# EAGLE design Edin_Usher_DRV2630_reference_design (EAGLE 9.6.2)
COMPANY: Unexpected Maker; DATE: 24-10-2018; DRAWN: Seon; REV: V1; TITLE: TinyPICO

## Sheet 1 of 2
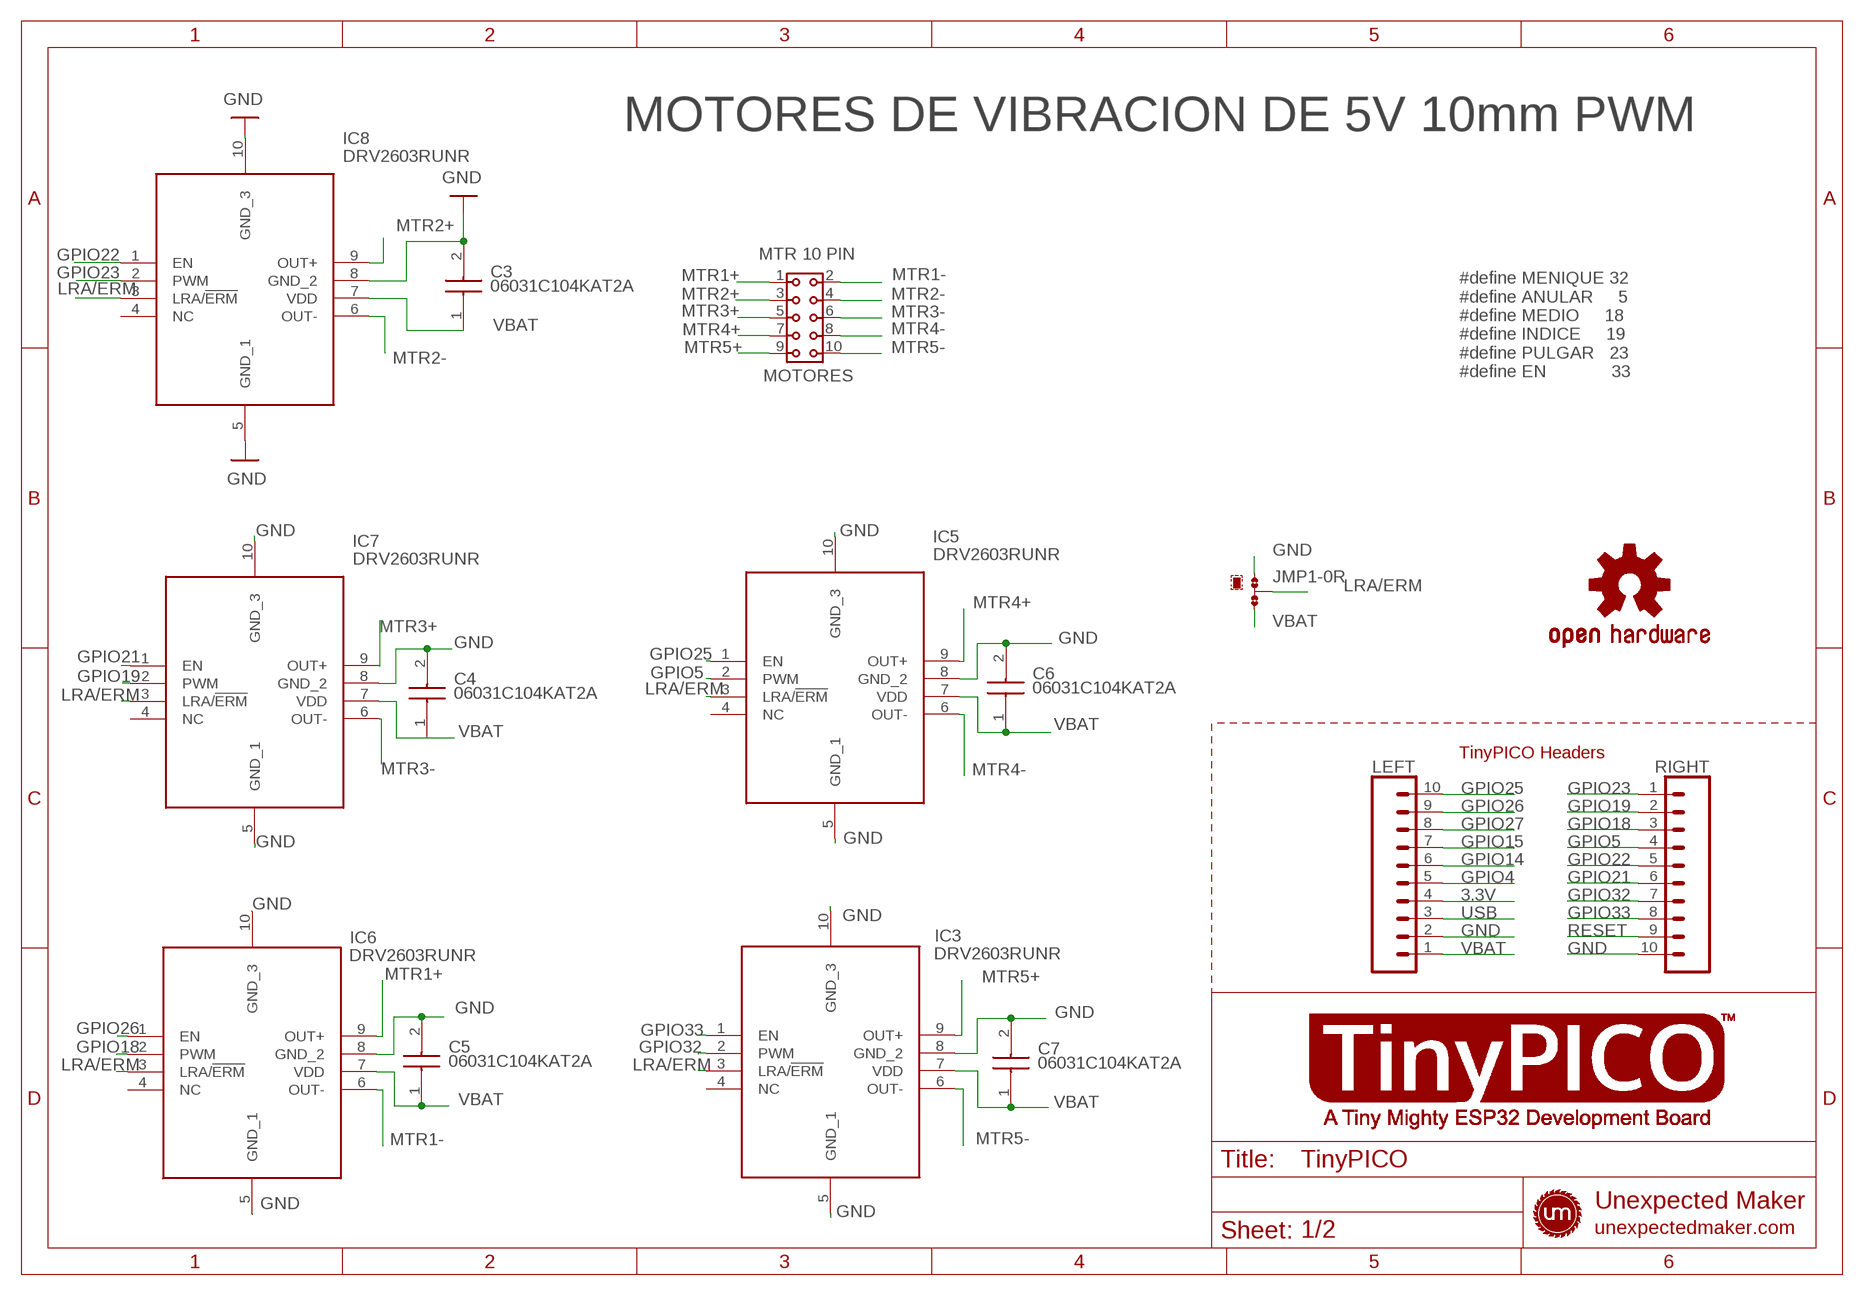
[diagram p0: schematic, sheet 1]

### Parts
C3  06031C104KAT2A  [CAPC1608X90N]
C4  06031C104KAT2A  [CAPC1608X90N]
C5  06031C104KAT2A  [CAPC1608X90N]
C6  06031C104KAT2A  [CAPC1608X90N]
C7  06031C104KAT2A  [CAPC1608X90N]
IC3  DRV2603RUNR  [QFN50P200X200X80-10N]
IC5  DRV2603RUNR  [QFN50P200X200X80-10N]
IC6  DRV2603RUNR  [QFN50P200X200X80-10N]
IC7  DRV2603RUNR  [QFN50P200X200X80-10N]
IC8  DRV2603RUNR  [QFN50P200X200X80-10N]
JMP1  0R-JUMPA  [A0R-JMP]
LEFT  TINYPICO_HEADER_10NO_SILK_PTH_FEMALE  [1X10_NO_SILK]
LOGO1  OSHW-LOGOS  [OSHW-LOGO-S]
MOTORES  MTR 10 PIN  6130XX21821_61301021821  [61301021821]
RIGHT  TINYPICO_HEADER_10NO_SILK_PTH_FEMALE  [1X10_NO_SILK]

### Nets
3.3V: LEFT.4 ; also sheet 2
GND: C3.2 C4.2 C5.2 C6.2 C7.2 IC3.5(GND_1) IC3.8(GND_2) IC3.10(GND_3) IC5.5(GND_1) IC5.8(GND_2) IC5.10(GND_3) IC6.5(GND_1) IC6.8(GND_2) IC6.10(GND_3) IC7.5(GND_1) IC7.8(GND_2) IC7.10(GND_3) IC8.5(GND_1) IC8.8(GND_2) IC8.10(GND_3) JMP1.1 LEFT.2 RIGHT.10 ; also sheet 2
GPIO4: LEFT.5 ; also sheet 2
GPIO5: IC5.2(PWM) RIGHT.4
GPIO14: LEFT.6 ; also sheet 2
GPIO15: LEFT.7 ; also sheet 2
GPIO18: IC6.2(PWM) RIGHT.3
GPIO19: IC7.2(PWM) RIGHT.2
GPIO21: IC7.1(EN) RIGHT.6
GPIO22: IC8.1(EN) RIGHT.5
GPIO23: IC8.2(PWM) RIGHT.1
GPIO25: IC5.1(EN) LEFT.10
GPIO26: IC6.1(EN) LEFT.9
GPIO27: LEFT.8 ; also sheet 2
GPIO32: IC3.2(PWM) RIGHT.7
GPIO33: IC3.1(EN) RIGHT.8
LRA/ERM: IC3.3(LRA/!ERM) IC5.3(LRA/!ERM) IC6.3(LRA/!ERM) IC7.3(LRA/!ERM) IC8.3(LRA/!ERM) JMP1.2
MTR1+: IC6.9(OUT+) MOTORES.1
MTR1-: IC6.6(OUT-) MOTORES.2
MTR2+: IC8.9(OUT+) MOTORES.3
MTR2-: IC8.6(OUT-) MOTORES.4
MTR3+: IC7.9(OUT+) MOTORES.5
MTR3-: IC7.6(OUT-) MOTORES.6
MTR4+: IC5.9(OUT+) MOTORES.7
MTR4-: IC5.6(OUT-) MOTORES.8
MTR5+: IC3.9(OUT+) MOTORES.9
MTR5-: IC3.6(OUT-) MOTORES.10
RESET: RIGHT.9 ; also sheet 2
USB: LEFT.3
VBAT: C3.1 C4.1 C5.1 C6.1 C7.1 IC3.7(VDD) IC5.7(VDD) IC6.7(VDD) IC7.7(VDD) IC8.7(VDD) JMP1.3 LEFT.1
Unconnected: IC3.4(NC) IC5.4(NC) IC6.4(NC) IC7.4(NC) IC8.4(NC)

### Notes on the sheet
- MOTORES DE VIBRACION DE 5V 10mm PWM
- #define MENIQUE 32
  #define ANULAR     5
  #define MEDIO     18
  #define INDICE     19
  #define PULGAR   23
  #define EN             33
- TinyPICO Headers

## Sheet 2 of 2: Botons
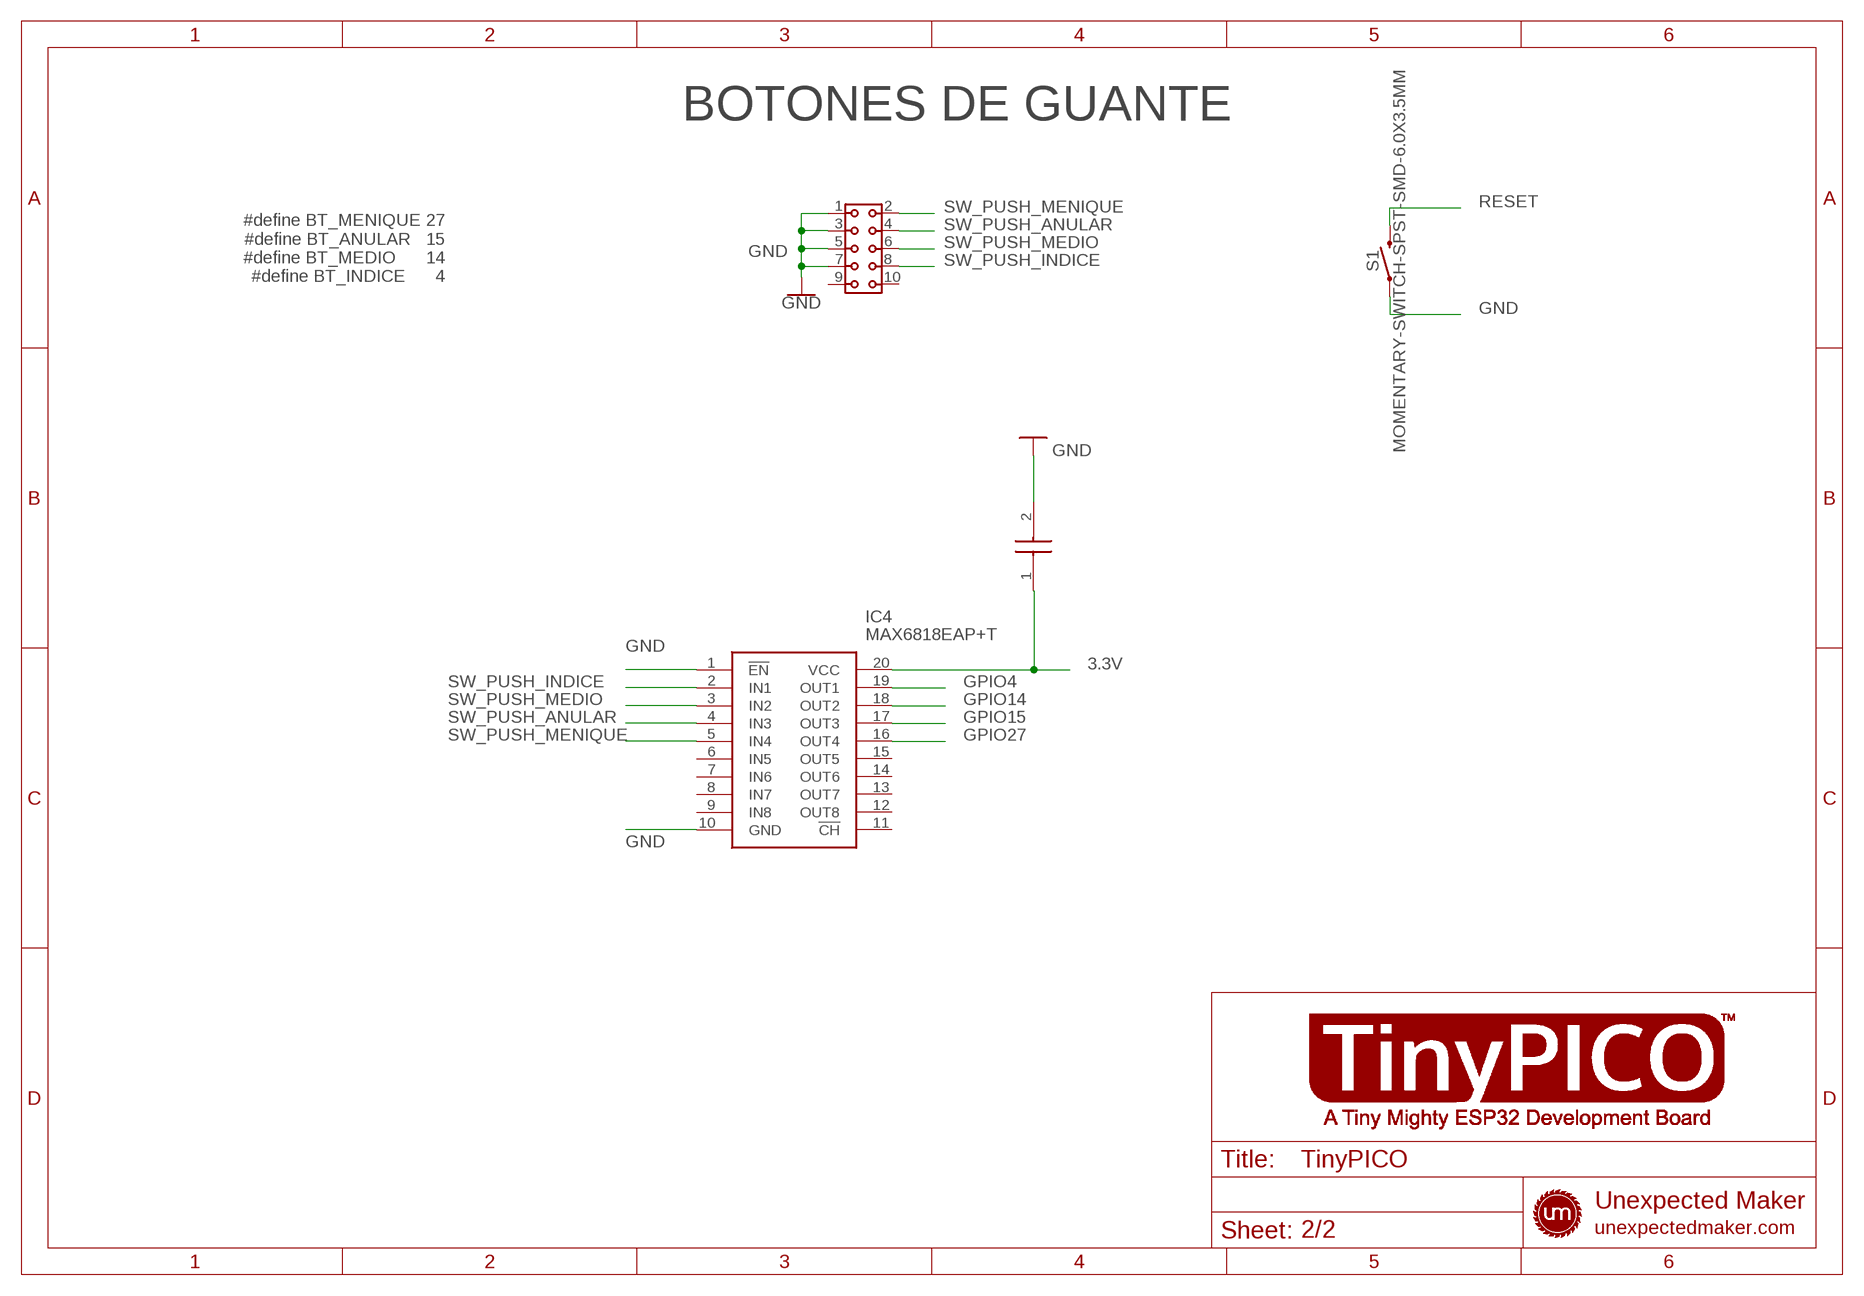
[diagram p1: schematic, sheet 2]

### Parts
BOTONES  BTN 10 PIN  6130XX21821_61301021821  [61301021821]
C8  0603B104K160CT  [CAPC1608X87N]
IC4  MAX6818EAP+T  [SOP65P778X199-20N]
S1  MOMENTARY-SWITCH-SPST-SMD-6.0X3.5MM  [TACTILE_SWITCH_SMD_6.0X3.5MM]

### Nets
3.3V: C8.1 IC4.20(VCC) ; also sheet 1
GND: BOTONES.1 BOTONES.3 BOTONES.5 BOTONES.7 C8.2 IC4.1(!EN) IC4.10(GND) S1.1 ; also sheet 1
GPIO4: IC4.19(OUT1) ; also sheet 1
GPIO14: IC4.18(OUT2) ; also sheet 1
GPIO15: IC4.17(OUT3) ; also sheet 1
GPIO27: IC4.16(OUT4) ; also sheet 1
RESET: S1.2 ; also sheet 1
SW_PUSH_ANULAR: BOTONES.4 IC4.4(IN3)
SW_PUSH_INDICE: BOTONES.8 IC4.2(IN1)
SW_PUSH_MEDIO: BOTONES.6 IC4.3(IN2)
SW_PUSH_MENIQUE: BOTONES.2 IC4.5(IN4)
Unconnected: BOTONES.9 BOTONES.10 IC4.6(IN5) IC4.7(IN6) IC4.8(IN7) IC4.9(IN8) IC4.11(!CH) IC4.12(OUT8) IC4.13(OUT7) IC4.14(OUT6) IC4.15(OUT5)

### Notes on the sheet
- BOTONES DE GUANTE
- #define BT_MENIQUE 27
  #define BT_ANULAR   15
  #define BT_MEDIO      14
  #define BT_INDICE      4

## Library data of the parts
BOTONES MOTORES = Wurth_Connectors_WR-PHD:6130XX21821_61301021821: WR-PHD 2.54 mm Dual Socket Header ARTICLE PROPERTIES: Pins:4;​ 6;​ 8;​ 10;​ 12;​ 14;​ 16;​ 18;​ 20;​ 22;​ 24;​ 26;​ 28;​ 30;​ 32;​ 34;​ 36;​ 40;​ 44;​ 64;​ 72 KIND PROPERTIES: Pitch：2.54 mm Quality Class:3 as per CECC 75 301-802 Rows：Dual Gender：Socket Header Type：Straight MATERIAL PROPERTIES: Insulator Material :PBT Insulator Flammability Rating:UL94 V-0 Contact Material:Copper Alloy Contact Plating:Gold Contact Type:Stamped GENERAL INFORMATION Operating Temperature:-40 up to +125 °C Compliance:Lead free / RoHS ELECTRICAL PROPERTIES: Rated Current:3 A IR 1:3 A Withstanding Voltage:500 V (AC) Contact Resistance:20 mΩ RISO:1000 MΩ CERTIFICATION UL Approval:E323964 PACKAGING PROPERTIES Packaging:Tray <https://katalog.we-online.com/media/images/v2/o57948v209%20Family_Dual_Socket_Header_WR-PHD_6130xx21821.jpg> Details see: https://katalog.we-online.com/en/em/PHD_2_54_DUAL_SOCKET_HEADER_6130XX21821 Updated by Yingchun,Shan 2019-10-21 2019 (C) Würth Elektronik; DATASHEET-URL: https://katalog.we-online.com/em/datasheet/61301021821.pdf; GENDER: Socket Header; IR: 3A; MATES: WR-PHD 2.54mm SMT Dual Pin Header/THT Angled Dual Pin Header/THT Dual Board Stacker/THT Dual Pin Header; PACKAGING: Tray; PART-NUMBER: 61301021821; PINS: 10; ROWS: Dual; TYPE: Straight
C3-C7 = SamacSys_Parts:06031C104KAT2A: AVX - 06031C104KAT2A - CAP, MLCC, X7R, 0.1UF, 100V, 0603 Source: Datasheet <https://componentsearchengine.com/Datasheets/1/06031A100FAT2A.pdf>; DESCRIPTION: AVX - 06031C104KAT2A - CAP, MLCC, X7R, 0.1UF, 100V, 0603; HEIGHT: 0.9mm; MANUFACTURER_NAME: AVX; MANUFACTURER_PART_NUMBER: 06031C104KAT2A; MOUSER_PART_NUMBER: 581-06031C104KAT2A; MOUSER_PRICE-STOCK: https://www.mouser.co.uk/ProductDetail/AVX/06031C104KAT2A?qs=oF%2FSscNnLpBUv12UcNAw2A%3D%3D
C8 = SamacSys_Parts:0603B104K160CT: WALSIN - 0603B104K160CT - CAP, 0.1F, 16V, 10%, X7R, 0603 Source: Datasheet <https://componentsearchengine.com/Datasheets/1/0603B104K160CT.pdf>; DESCRIPTION: WALSIN - 0603B104K160CT - CAP, 0.1F, 16V, 10%, X7R, 0603; HEIGHT: 0.87mm; MANUFACTURER_NAME: Walsin Technology Corporation; MANUFACTURER_PART_NUMBER: 0603B104K160CT; MOUSER_PART_NUMBER: 791-0603B104K160CT; MOUSER_PRICE-STOCK: https://www.mouser.com/Search/Refine.aspx?Keyword=791-0603B104K160CT
IC3 IC5-IC8 = SamacSys_Parts:DRV2603RUNR: Haptic Driver with Auto Resonance Tracking for LRA and Optimized Drive for ERM Source: Datasheet <http://www.ti.com/lit/gpn/drv2603>; DESCRIPTION: Haptic Driver with Auto Resonance Tracking for LRA and Optimized Drive for ERM; HEIGHT: 0.8mm; MANUFACTURER_NAME: Texas Instruments; MANUFACTURER_PART_NUMBER: DRV2603RUNR; MOUSER_PART_NUMBER: 595-DRV2603RUNR; MOUSER_PRICE-STOCK: https://www.mouser.co.uk/ProductDetail/Texas-Instruments/DRV2603RUNR?qs=l6ZoeTYLMwNhoGl8Q31%2FaA%3D%3D
IC4 = SamacSys_Parts:MAX6818EAP+T: MAXIM INTEGRATED PRODUCTS - MAX6818EAP+T. - ESD PROTE WITH SWITCH DEBOUNCER, SSOP-20 Source: Datasheet; DESCRIPTION: MAXIM INTEGRATED PRODUCTS - MAX6818EAP+T. - ESD PROTE WITH SWITCH DEBOUNCER, SSOP-20; HEIGHT: 1.99mm; MANUFACTURER_NAME: Maxim Integrated; MANUFACTURER_PART_NUMBER: MAX6818EAP+T; MOUSER_PART_NUMBER: 700-MAX6818EAPT; MOUSER_PRICE-STOCK: https://www.mouser.co.uk/ProductDetail/Maxim-Integrated/MAX6818EAP%2bT?qs=CDqwynd4ZNoKt6d34O8j%252BA%3D%3D
JMP1 = jump-0r-smd:0R-JUMP: SMD 0R 0805 Jumper
LEFT RIGHT = UnexpectedMaker:TINYPICO_HEADER_10: Multi connection point. Often used as Generic Header-pin footprint for 0.1 inch spaced/style header connections On any of the 0.1 inch spaced packages, you can populate with these: Break Away Headers - Straight <https://www.sparkfun.com/products/116> (PRT-00116) Break Away Male Headers - Right Angle <https://www.sparkfun.com/products/553> (PRT-00553) Female Headers <https://www.sparkfun.com/products/115> (PRT-00115) Break Away Headers - Machine Pin <https://www.sparkfun.com/products/117> (PRT-00117) Break Away Female Headers - Swiss Machine Pin <https://www.sparkfun.com/products/743> (PRT-00743) Arduino Stackable Header - 10 Pin <https://www.sparkfun.com/products/11376> (PRT-11376) For SCREWTERMINALS and SPRING TERMINALS visit here: Screw Terimnals on SparkFun.com <https://www.sparkfun.com/search/results?term=Screw+Terminals> (5mm/3.5mm/2.54mm spacing) This device is also useful as a general connection point to wire up your design to another part of your project. Our various solder wires solder well into these plated through hole pads. Hook-Up Wire - Assortment (Stranded, 22 AWG) <https://www.sparkfun.com/products/11375> (PRT-11375) Hook-Up Wire - Assortment (Solid Core, 22 AWG) <https://www.sparkfun.com/products/11367> (PRT-11367) View the entire wire category on our website here <https://www.sparkfun.com/categories/141> Special notes: Molex polarized connector foot print use with SKU : PRT-08231 with associated crimp pins and housings. 1MM SMD Version SKU: PRT-10208 NOTES ON THE VARIANTS LOCK and LOCK_LONGPADS... This footprint was designed to help hold the alignment of a through-hole component (i.e. 6-pin header) while soldering it into place. You may notice that each hole has been shifted either up or down by 0.005 of an inch from it's more standard position (which is a perfectly straight line). This slight alteration caused the pins (the squares in the middle) to touch the edges of the holes. Because they are alternating, it causes a "brace" to hold the component in place. 0.005 has proven to be the perfect amount of "off-center" position when using our standard breakaway headers. Although looks a little odd when you look at the bare footprint, once you have a header in there, the alteration is very hard to notice. Also,if you push a header all the way into place, it is covered up entirely on the bottom side.; PROD_ID: CONN-11563
LOGO1 = SparkFun-Aesthetics:OSHW-LOGO: Open-Source Hardware (OSHW) Logo This logo indicates the piece of hardware it is found on incorporates a OSHW license and/or adheres to the definition of open source hardware found here: http://freedomdefined.org/OSHW
S1 = SparkFun-Switches:MOMENTARY-SWITCH-SPST: Momentary Switch (Pushbutton) - SPST Normally-open (NO) SPST momentary switches (buttons, pushbuttons). Variants PTH-12MM - 12mm square, through-hole Momentary Pushbutton Switch - 12mm Square <https://www.sparkfun.com/products/9190> (COM-09190) PTH-6.0MM, PTH-6.0MM-KIT - 6.0mm square, through-hole Mini Pushbutton Switch <https://www.sparkfun.com/products/97> (COM-00097) KIT package intended for soldering kit's - only one side of pads' copper is exposed. PTH-RIGHT-ANGLE-KIT - Right-angle, through-hole Right Angle Tactile Button <https://www.sparkfun.com/products/10791> - Used on SparkFun BigTime Watch Kit <https://www.sparkfun.com/products/11734> SMD-12MM - 12mm square, surface-mount Tactile Button - SMD (12mm) <https://www.sparkfun.com/products/12993> (COM-12993) Used on SparkFun PicoBoard <https://www.sparkfun.com/products/11888> SMD-4.5MM - 4.5mm Square Trackball Switch Used on SparkFun Blackberry Trackballer Breakout <https://www.sparkfun.com/products/13169> SMD-4.6MMX2.8MM - 4.60mm x 2.80mm, surface mount Used on SparkFun SAMD21 Mini Breakout <https://www.sparkfun.com/products/13664> SMD-5.2MM, SMD-5.2-REDUNDANT - 5.2mm square, surface-mount Mini Pushbutton Switch - SMD <https://www.sparkfun.com/products/8720> (COM-08720) Used on Arduino Pro Mini <https://www.sparkfun.com/products/11114> REDUNDANT package connects both switch circuits together SMD-6.0X3.5MM - 6.0 x 3.5mm, surface mount Momentary Reset Switch SMD <https://www.sparkfun.com/products/8229> (COM-08229) SMD-6.2MM-TALL - 6.2mm square, surface mount Tactile Button - SMD (6mm) <https://www.sparkfun.com/products/12992> Used on SparkFun Digital Sandbox <https://www.sparkfun.com/products/12651> SMD-RIGHT-ANGLE - Right-angle, surface mount Used on SparkFun Block for Intel® Edison - Arduino <https://www.sparkfun.com/products/13036>; PROD_ID: SWCH-00815; SF_SKU: COM-08229

## Board
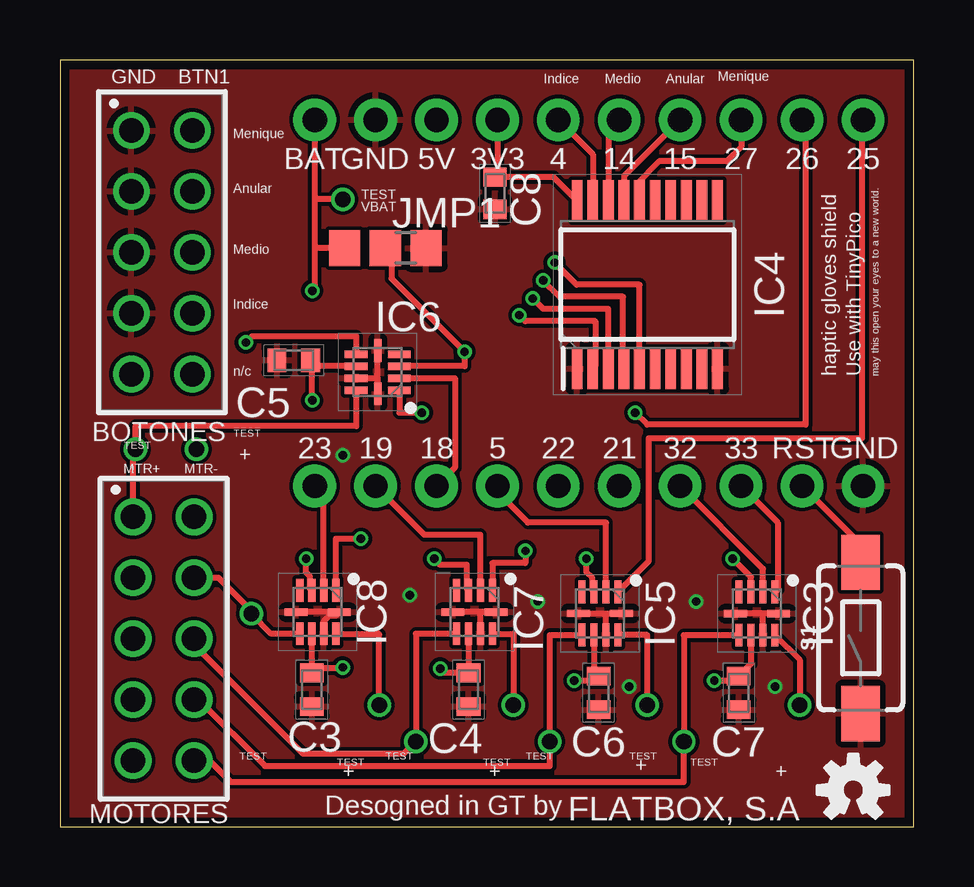
[diagram p2: board, top side]
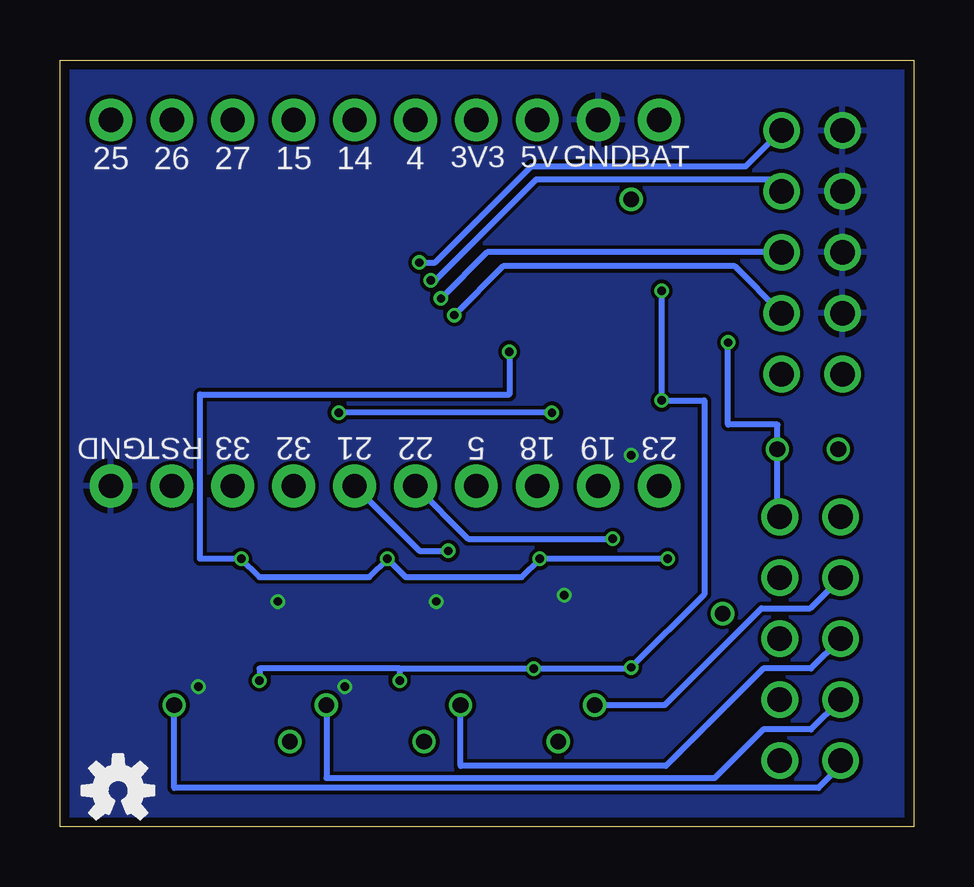
[diagram p3: board, bottom side, seen from below]

Size 35.6 x 31.97 mm. Coordinates in mm from the lower left corner, seen from the top.
Outline: 0,31.97 0,0 35.6,0 35.6,31.97 0,31.97
Copper layers (1*16): Top 0.035559375mm / dielectric 1.6mm / Bottom 0.035559375mm
Design rules "oshpark-2layer": minimum track width 6mil, minimum drill 10mil, track to track 6mil, track to pad 6mil, pad to pad 6mil, via to via 6mil, smd to smd 6mil, copper to edge 15mil, drill to drill 6mil, minimum pad ring 5mil, minimum via ring 5mil, stop-mask expansion 2.5mil, vias tented up to drill 0mil, thermal gap 10mil

### Footprints (pad centres in the part's own frame; a part is rotated, then mirrored left to right if it is on the bottom)
61301021821 = drill 1.02: 1 -5.08,-1.27; 2 -5.08,1.27; 3 -2.54,-1.27; 4 -2.54,1.27; 5 0,-1.27; 6 0,1.27; 7 2.54,-1.27; 8 2.54,1.27; 9 5.08,-1.27; 10 5.08,1.27
CAPC1608X90N = smd 0.78 x 0.99: 1 -0.7,0; 2 0.7,0
CAPC1608X87N = smd 0.8 x 0.94: 1 -0.67,0; 2 0.67,0
QFN50P200X200X80-10N = smd 0.95 x 0.3: 1 -0.9,0.75; 2 -0.9,0.25; 3 -0.9,-0.25; 4 -0.9,-0.75; 6 0.9,-0.75; 7 0.9,-0.25; 8 0.9,0.25; 9 0.9,0.75 | smd 0.3 x 0.95: 5 0,-0.9; 10 0,0.9
SOP65P778X199-20N = smd 1.705 x 0.45: 1 -3.498,2.925; 2 -3.498,2.275; 3 -3.498,1.625; 4 -3.498,0.975; 5 -3.498,0.325; 6 -3.498,-0.325; 7 -3.498,-0.975; 8 -3.498,-1.625; 9 -3.498,-2.275; 10 -3.498,-2.925; 11 3.498,-2.925; 12 3.498,-2.275; 13 3.498,-1.625; 14 3.498,-0.975; 15 3.498,-0.325; 16 3.498,0.325; 17 3.498,0.975; 18 3.498,1.625; 19 3.498,2.275; 20 3.498,2.925
A0R-JMP = smd 1.5 x 1.3: 1 0,1.7; 2 0,0; 3 0,-1.7
1X10_NO_SILK = drill 1.016 pad 1.778: 1 0,0; 2 2.54,0; 3 5.08,0; 4 7.62,0; 5 10.16,0; 6 12.7,0; 7 15.24,0; 8 17.78,0; 9 20.32,0; 10 22.86,0
TACTILE_SWITCH_SMD_6.0X3.5MM = smd 2.3 x 1.6: 1 -3.15,0; 2 3.15,0

### Placement (x,y rotation side)
BOTONES  4.25,23.95 270 top
C3  10.5,5.71 270 top
C4  17.03,5.71 270 top
C5  9.75,19.45 180 top
C6  22.45,5.59 270 top
C7  28.3,5.59 270 top
C8  18.14,26.41 270 top
IC3  29.06,8.89 270 top
IC4  24.49,22.6 90 top
IC5  22.51,8.9 270 top
IC6  13.25,18.95 180 top
IC7  17.28,8.95 270 top
IC8  10.75,8.95 270 top
JMP1  13.56,24.13 270 top
LEFT  10.62,29.47 0 top
LOGO1  33.07,1.53 0 top
LOGO2  OSHW-LOGOS  [OSHW-LOGO-S]  33.17,1.51 0 bottom
MOTORES  4.32,7.84 270 top
RIGHT  10.62,14.21 0 top
S1  33.38,7.87 90 top

### Tracks (layer width: path | path; a pad name or v marks a point on that pad's centre or on a via)
3.3V
  Top 0.254: LEFT.4 18.24,27.19 C8.1 20.58,27.08 IC4.20
GND  (via drill 0.35)
  Top 0.254: IC8.8 11,8.57 11.23,8.81 11.5,8.81 IC8.10 IC8.5 | IC6.8 13.25,18.7 IC6.10 IC6.5 | 21.86,8.9 IC5.5 22.76,8.9 | IC3.10 29.31,8.89 | 29.31,8.89 IC3.5 | IC3.8 29.31,8.89 | 22.76,8.9 IC5.10 | IC5.8 22.76,8.9 | IC7.10 17.53,8.95 | 17.53,8.95 IC7.5 | IC7.8 17.53,8.95
  other vias: 23.72,5.84 14.58,9.65 19.91,9.4 29.82,5.84 26.52,9.4 11.79,15.49
  pour Bottom: 35.63,33.37 35.63,-3.68 -1.02,-3.68 -1.02,33.37
  pour Top: -1.17,33.53 -1.17,-4.57 35.66,-4.57 35.66,33.53
GPIO4
  Top 0.254: LEFT.5 22.21,28.04 IC4.19
GPIO5
  Top 0.254: IC5.2 22.76,12.69 19.51,12.69 18.24,13.96 RIGHT.4
GPIO14
  Top 0.254: LEFT.6 22.86,29.02 IC4.18
GPIO15
  Top 0.254: LEFT.7 23.51,27.13 IC4.17
GPIO18
  Top 0.254: IC6.2 16.46,18.7 16.46,14.97 RIGHT.3
GPIO19
  Top 0.254: IC7.2 17.52,9.87 17.52,12.18 15.19,12.18 RIGHT.2
GPIO21  (via drill 0.35)
  Top 0.254: v19.41,11.5 19.41,10.99 18.03,10.99 IC7.1
  Bottom 0.254: RIGHT.6 20.61,11.5 v19.41,11.5
GPIO22  (via drill 0.35)
  Top 0.254: v12.55,12.01 11.5,12.01 IC8.1
  Bottom 0.254: RIGHT.5 18.58,12.01 v12.55,12.01
GPIO23
  Top 0.254: IC8.2 11,13.83 RIGHT.1
GPIO25
  Top 0.254: IC5.1 24.53,11.07 24.53,16.2 33.44,16.2 33.44,29.48 LEFT.10
GPIO26  (via drill 0.35)
  Top 0.254: IC6.1 14.15,17.27 v15.09,17.27 | v23.98,17.27 24.49,16.76 31.09,16.76 31.09,29.48 LEFT.9
  Bottom 0.254: v15.09,17.27 v23.98,17.27
GPIO27
  Top 0.254: LEFT.8 28.4,28.35 27.79,27.74 24.98,27.74 24.05,26.82 24.05,26.21 IC4.16
GPIO32
  Top 0.254: IC3.2 29.31,10.76 RIGHT.7
GPIO33
  Top 0.254: RIGHT.8 29.92,12.69 29.92,9.9 IC3.1
LRA/ERM  (via drill 0.35)
  Top 0.254: JMP1.2 13.82,23.87 13.82,22.86 v16.87,19.81 16.87,19.2 IC6.3 | IC8.3 10.43,9.92 10.43,10.44 10.26,10.61 v10.26,11.17 | IC7.3 16.96,9.92 16.96,10.92 15.85,10.92 v15.6,11.17 | IC5.3 22.19,9.87 22.19,10.39 21.95,10.63 v21.95,11.17 | IC3.3 28.81,10.41 v28.04,11.17
  Bottom 0.254: v10.26,11.17 v15.6,11.17 16.36,10.41 21.18,10.41 v21.95,11.17 22.71,10.41 27.28,10.41 v28.04,11.17 29.76,11.17 29.76,18.03 16.87,18.03 v16.87,19.81
MTR1+  (via drill 0.65)
  Top 0.254: IC6.9 12.35,16.71 3.15,16.71 v3.15,15.75 3.05,15.65 MOTORES.1
MTR1-  (via drill 0.35, 0.65)
  Top 0.254: v7.75,20.19 8,20.44 12.35,20.44 IC6.6
  Bottom 0.254: v7.75,20.19 7.75,16.76 5.69,16.76 v5.69,15.75 5.69,13.02 MOTORES.2
MTR2+  (via drill 0.65)
  Top 0.254: v13.31,5.08 13.31,8.02 13.26,8.07 13.24,8.05 IC8.9
  Bottom 0.254: v13.31,5.08 10.39,5.08 6.35,9.11 4.32,9.11 MOTORES.3
MTR2-  (via drill 0.65)
  Top 0.254: IC8.6 8.81,8.05 v7.98,8.89 7.98,9.01 6.61,10.38 MOTORES.4
MTR3+  (via drill 0.65)
  Top 0.254: IC7.9 18.9,8.05 v18.9,5.08
  Bottom 0.254: MOTORES.5 4.29,6.6 6.28,6.6 10.34,2.54 18.9,2.54 v18.9,5.08
MTR3-  (via drill 0.65)
  Top 0.254: MOTORES.6 5.59,7.59 10.13,3.05 14.33,3.05 v14.83,3.55 14.83,8.05 IC7.6
MTR4+  (via drill 0.65)
  Top 0.254: v24.49,5.08 24.49,8 IC5.9
  Bottom 0.254: MOTORES.7 4.29,4.06 6.28,4.06 8.31,2.03 24.49,2.03 v24.49,5.08
MTR4-  (via drill 0.65)
  Top 0.254: IC5.6 20.42,8 v20.42,3.55 20.42,2.53 8.55,2.53 5.78,5.3 MOTORES.8
MTR5+  (via drill 0.65)
  Top 0.254: IC3.9 30.84,6.96 v30.84,5.08
  Bottom 0.254: MOTORES.9 3.05,2.55 3.98,1.62 30.84,1.62 v30.84,5.08
MTR5-  (via drill 0.65)
  Top 0.254: IC3.6 26.01,7.99 v26.01,3.55 26.01,1.87 7.11,1.87 6.22,2.76 MOTORES.10
RESET
  Top 0.254: RIGHT.9 33.38,11.77 S1.2
SW_PUSH_ANULAR  (via drill 0.35)
  Top 0.254: IC4.4 23.47,19.11 23.47,22.1 20.82,22.1 v20.14,22.78
  Bottom 0.254: v20.14,22.78 19.96,22.78 15.74,27 6.02,27 BOTONES.4
SW_PUSH_INDICE  (via drill 0.35)
  Top 0.254: IC4.2 22.32,19.21 22.32,21.08 19.41,21.08 v19.15,21.33
  Bottom 0.254: BOTONES.8 7.47,23.37 17.12,23.37 v19.15,21.33
SW_PUSH_MEDIO  (via drill 0.35)
  Top 0.254: IC4.3 22.86,21.59 20.15,21.59 v19.71,22.02
  Bottom 0.254: BOTONES.6 17.79,23.95 v19.71,22.02
SW_PUSH_MENIQUE  (via drill 0.35)
  Top 0.254: IC4.5 24.16,22.6 21.54,22.6 v20.62,23.52
  Bottom 0.254: BOTONES.2 7.01,27.54 15.94,27.54 19.96,23.52 v20.62,23.52
VBAT  (via drill 0.35, 0.65)
  Top 0.254: IC8.7 C3.1 10.69,6.6 11.74,6.6 v11.79,6.64 | v21.44,6.09 22.26,6.09 C6.1 22.26,6.29 IC5.7 | IC3.7 28.81,6.8 C7.1 28.1,6.09 v27.28,6.09 | IC6.7 10.45,19.2 C5.1 10.52,19.45 v10.52,17.78 | IC7.7 C4.1 15.85,6.41 v15.85,6.6 | LEFT.1 10.62,26.16 | 10.62,26.16 10.62,24.13 | 10.62,24.13 10.62,22.45 v10.52,22.35 | v11.79,26.16 10.62,26.16 | JMP1.3 10.62,24.13
  Bottom 0.254: v10.52,22.35 v10.52,17.78 8.74,17.78 8.74,9.69 v11.79,6.64 11.83,6.6 v15.85,6.6 21.44,6.6 | 21.44,6.6 v21.44,6.09 | 21.44,6.6 27.28,6.6 v27.28,6.09

### Text on the board
tPlace: Menique | GND | BTN1 | Indice | Medio | Anular | Menique | Anular | TEST | VBAT | Medio | Indice | n/c | haptic gloves shield | Use with TinyPico | may this open your eyes to a new world. | TEST | TEST | + | TEST | TEST | TEST | TEST | TEST | TEST | TEST | + | + | + | + | Desogned in GT by | FLATBOX, S.A
tNames: BAT | GND | 5V | 3V3 | 4 | 14 | 15 | 27 | 26 | 25 | 23 | 19 | 18 | 5 | 22 | 21 | 32 | 33 | RST | GND | MTR+ | MTR-
bNames: BAT | GND | 5V | 3V3 | 4 | 14 | 15 | 27 | 26 | 25 | RST | GND | 23 | 19 | 18 | 5 | 22 | 21 | 32 | 33